# EAGLE schematic CM4 (EAGLE 9.6.2)
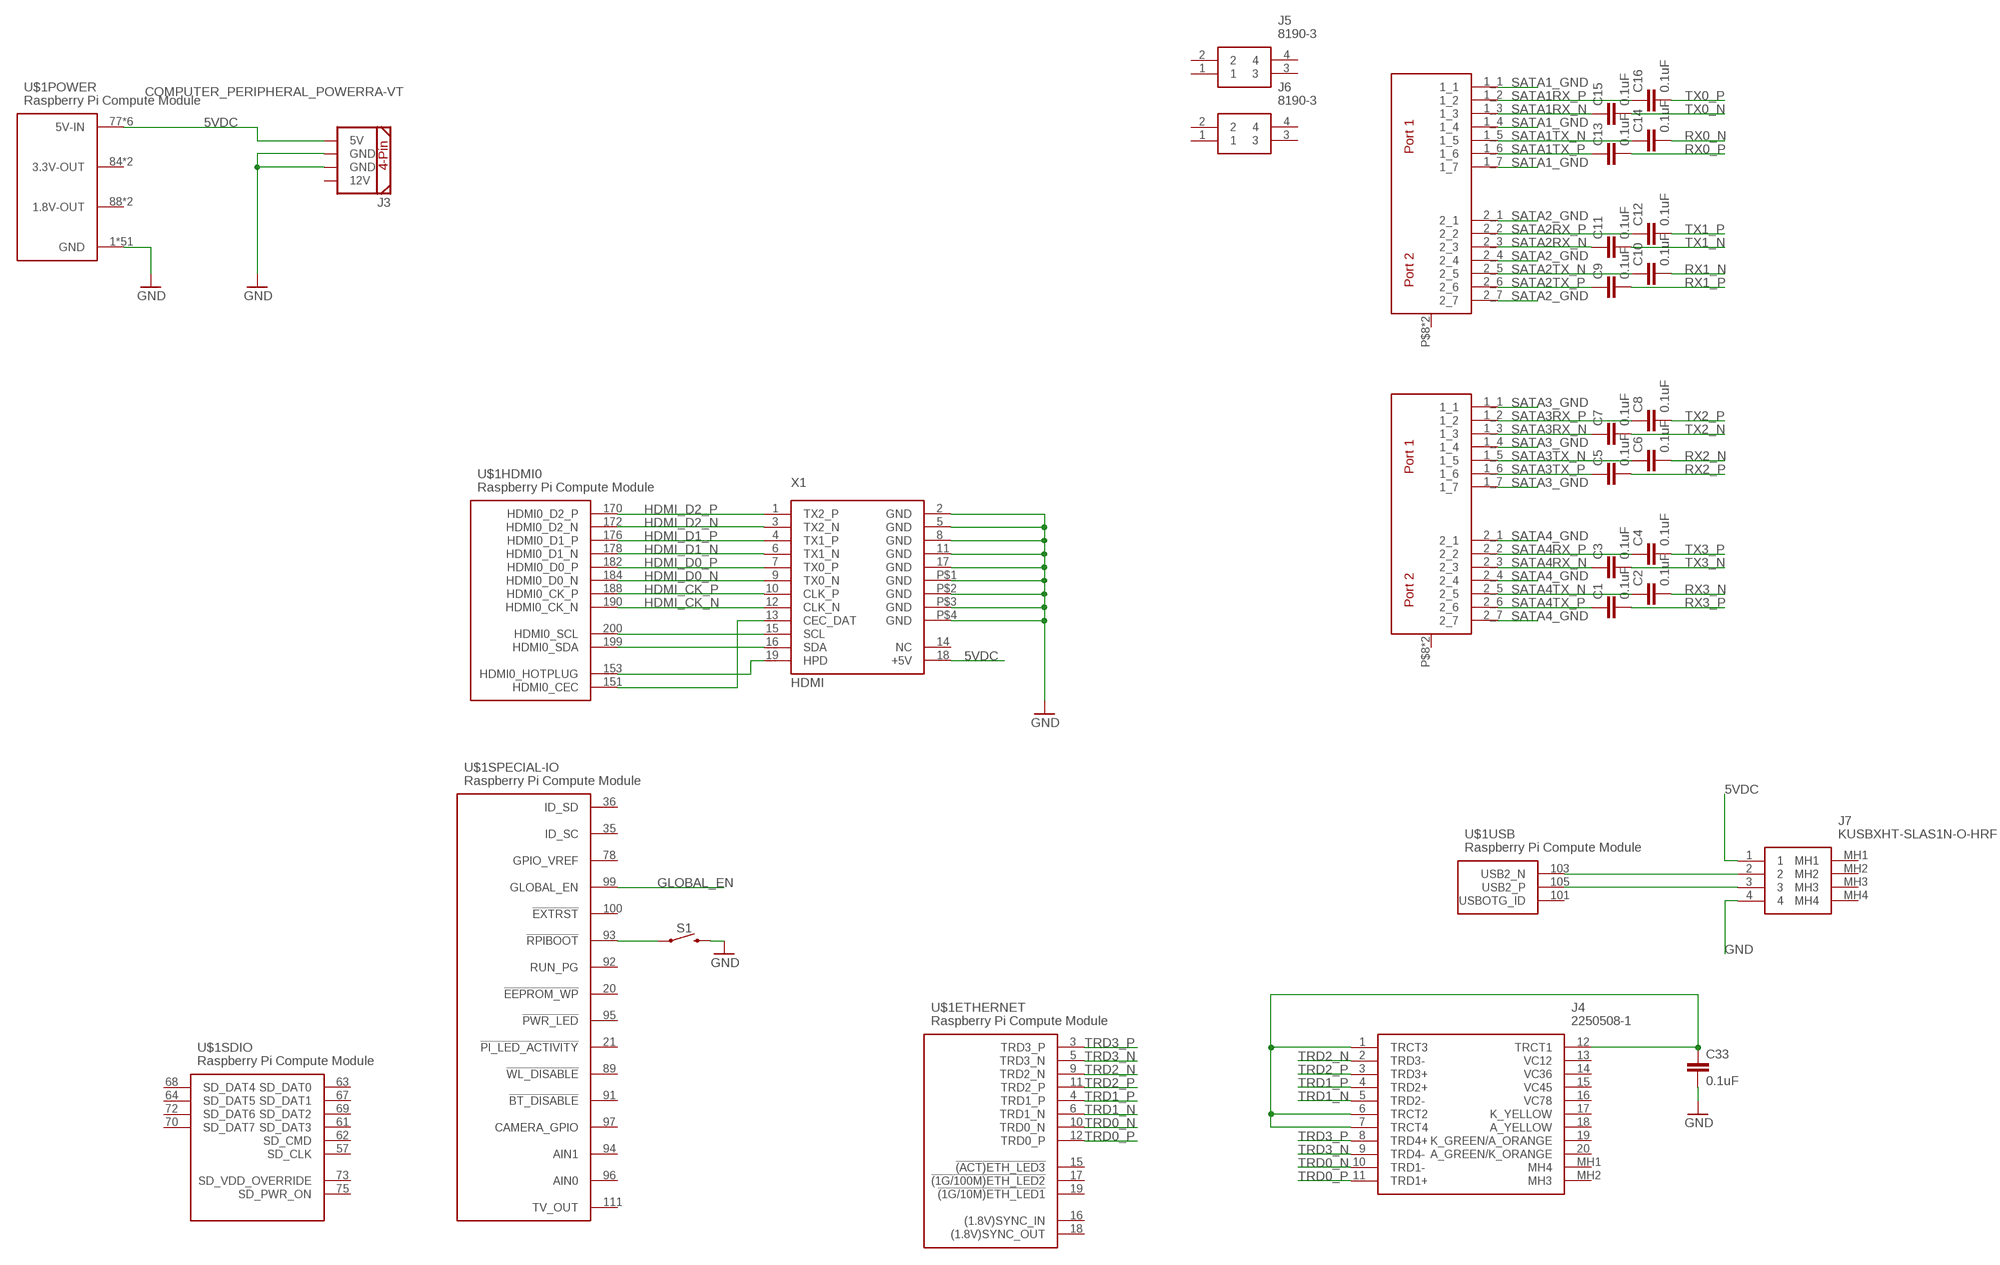
[diagram p0: schematic, sheet 1, part 1 of 2]
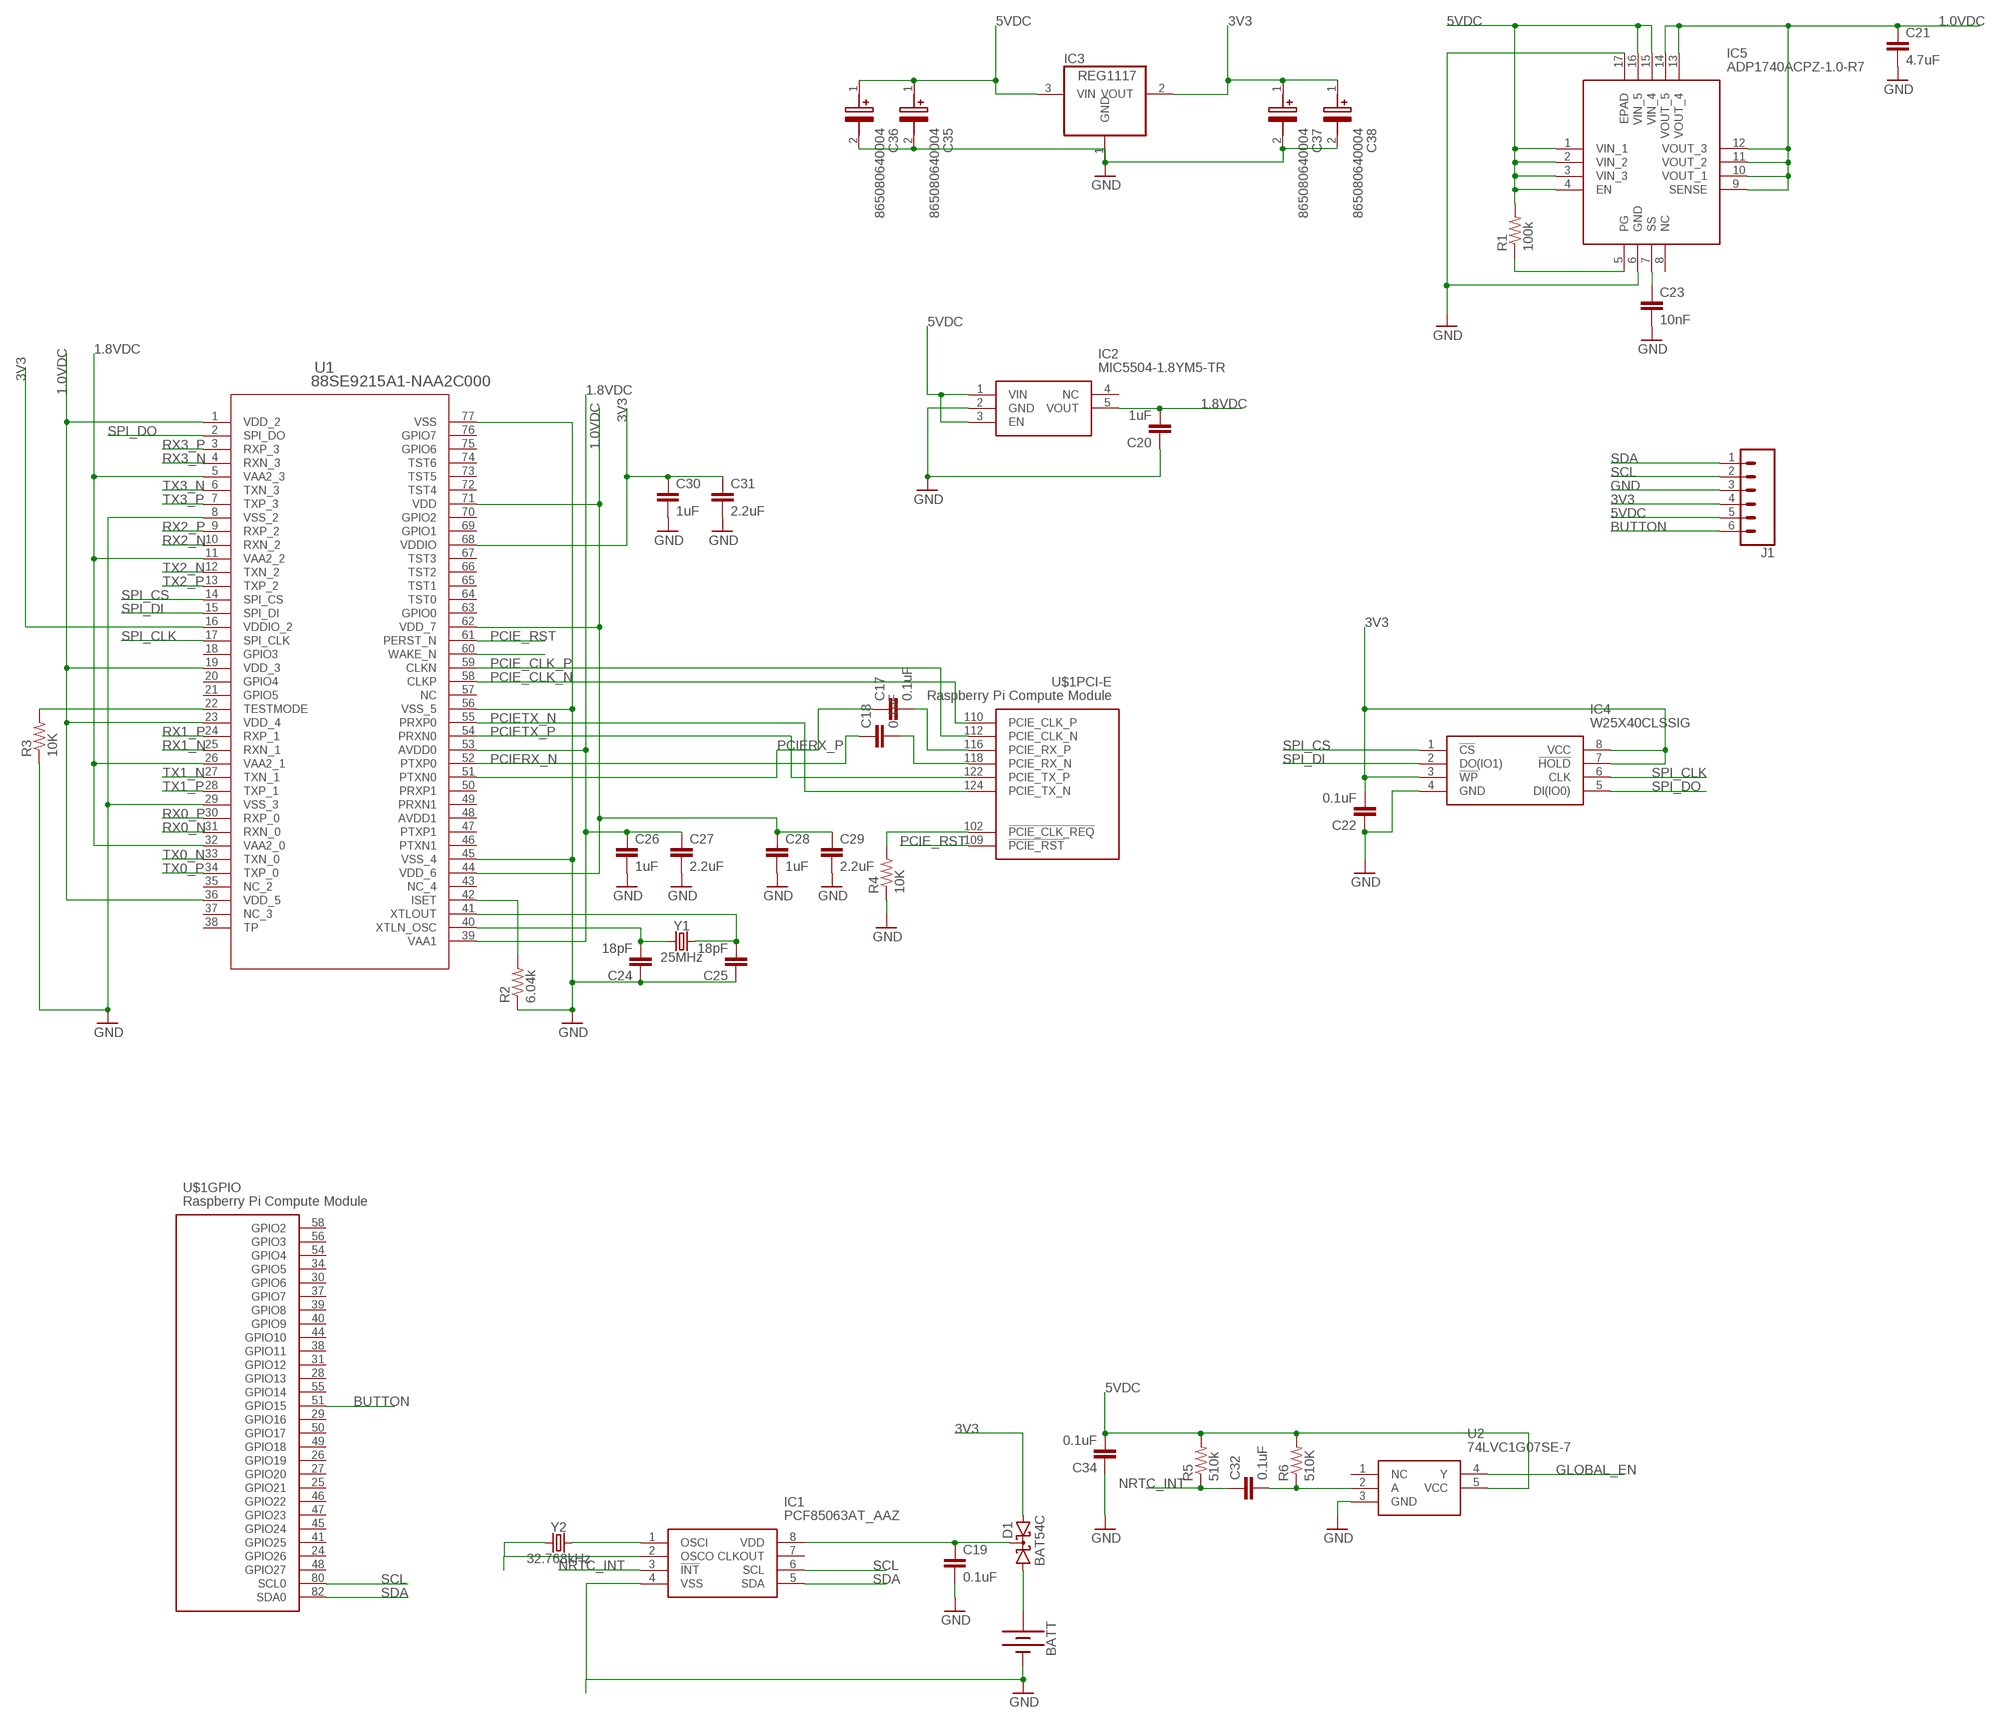
[diagram p1: schematic, sheet 1, part 2 of 2]

## Parts
BATT  BATTERY-12MM_SMD  [BATTCON_12MM]
C1  0.1uF  0.1UF-0603-25V-5%  [0603]
C2  0.1uF  0.1UF-0603-25V-5%  [0603]
C3  0.1uF  0.1UF-0603-25V-5%  [0603]
C4  0.1uF  0.1UF-0603-25V-5%  [0603]
C5  0.1uF  0.1UF-0603-25V-5%  [0603]
C6  0.1uF  0.1UF-0603-25V-5%  [0603]
C7  0.1uF  0.1UF-0603-25V-5%  [0603]
C8  0.1uF  0.1UF-0603-25V-5%  [0603]
C9  0.1uF  0.1UF-0603-25V-5%  [0603]
C10  0.1uF  0.1UF-0603-25V-5%  [0603]
C11  0.1uF  0.1UF-0603-25V-5%  [0603]
C12  0.1uF  0.1UF-0603-25V-5%  [0603]
C13  0.1uF  0.1UF-0603-25V-5%  [0603]
C14  0.1uF  0.1UF-0603-25V-5%  [0603]
C15  0.1uF  0.1UF-0603-25V-5%  [0603]
C16  0.1uF  0.1UF-0603-25V-5%  [0603]
C17  0.1uF  0.1UF-0603-25V-5%  [0603]
C18  0.1uF  0.1UF-0603-25V-5%  [0603]
C19  0.1uF  0.1UF-0603-25V-5%  [0603]
C20  1uF  0.1UF-0603-25V-5%  [0603]
C21  4.7uF  4.7UF-0603-6.3V-(10%)  [0603]
C22  0.1uF  0.1UF-0603-25V-5%  [0603]
C23  10nF  4.7UF-0603-6.3V-(10%)  [0603]
C24  18pF  0.1UF-0603-25V-5%  [0603]
C25  18pF  0.1UF-0603-25V-5%  [0603]
C26  1uF  4.7UF-0603-6.3V-(10%)  [0603]
C27  2.2uF  4.7UF-0603-6.3V-(10%)  [0603]
C28  1uF  4.7UF-0603-6.3V-(10%)  [0603]
C29  2.2uF  4.7UF-0603-6.3V-(10%)  [0603]
C30  1uF  4.7UF-0603-6.3V-(10%)  [0603]
C31  2.2uF  4.7UF-0603-6.3V-(10%)  [0603]
C32  0.1uF  0.1UF-0603-25V-5%  [0603]
C33  0.1uF  0.1UF-0603-25V-5%  [0603]
C34  0.1uF  0.1UF-0603-25V-5%  [0603]
C35  865080640004  [865080640004]
C36  865080640004  [865080640004]
C37  865080640004  [865080640004]
C38  865080640004  [865080640004]
D1  BAT54C  [SOT23]
IC1  PCF85063AT_AAZ  [SOIC127P600X175-8N]
IC2  MIC5504-1.8YM5-TR  [SOT95P280X145-5N]
IC3  REG1117  [SOT223]
IC4  W25X40CLSSIG  [SOIC127P790X216-8N]
IC5  ADP1740ACPZ-1.0-R7  [QFN65P400X400X80-17N]
J1  CONN_06LOCK  [1X06_LOCK]
J3  COMPUTER_PERIPHERAL_POWERRA-VT  [COMPUTER-PERIPHERAL-POWER-RA-VT]
J4  2250508-1  [22505081]
J5  8190-3  [81903]
J6  8190-3  [81903]
J7  KUSBXHT-SLAS1N-O-HRF  [KUSBXHTSLAS1NOHRF]
R1  100k  R-US_R0603  [R0603]
R2  6.04k  R-US_R0603  [R0603]
R3  10K  R-US_R0603  [R0603]
R4  10K  R-US_R0603  [R0603]
R5  510k  R-US_R0603  [R0603]
R6  510K  R-US_R0603  [R0603]
S1  MOMENTARY-SWITCH-SPST-SMD-5.2-REDUNDANT  [TACTILE_SWITCH_SMD_5.2MM]
U1  88SE9215A1-NAA2C000  [QFN76_9X9_MTG]
U2  74LVC1G07SE-7  [SOT65P210X110-5N]
U$1  Raspberry Pi Compute Module  RASPBERRYPI-CM4  [RASPBERRYPI-CM4]
U$2  SATA-D-PL-RT  [RIGHTANGLE2PORTSATA]
U$3  SATA-D-PL-RT  [RIGHTANGLE2PORTSATA]
X1  HDMI  [HDMI]
Y1  25MHz  CRYSTAL-25MHZ-SMD-2.0X1.6MM  [CRYSTAL-SMD-2.0X1.6MM]
Y2  32.768kHz  CRYSTAL-32.768KHZSMD-3.2X1.5  [CRYSTAL-SMD-3.2X1.5MM]

## Nets
1.0VDC: C21.1 C28.1 C29.1 IC5.9(SENSE) IC5.10(VOUT_1) IC5.11(VOUT_2) IC5.12(VOUT_3) IC5.13(VOUT_4) IC5.14(VOUT_5) U1.1(VDD_2) U1.19(VDD_3) U1.23(VDD_4) U1.36(VDD_5) U1.44(VDD_6) U1.62(VDD_7) U1.71(VDD)
1.8VDC: C20.2 C26.1 C27.1 IC2.5(VOUT) U1.5(VAA2_3) U1.11(VAA2_2) U1.26(VAA2_1) U1.32(VAA2_0) U1.39(VAA1) U1.53(AVDD0)
3V3: C22.2 C30.1 C31.1 C37.1(+) C38.1(+) D1.2(A2) IC3.2(VOUT) IC4.3(!WP) IC4.7(!HOLD) IC4.8(VCC) J1.4 U1.16(VDDIO_2) U1.68(VDDIO)
5VDC: C34.2 C35.1(+) C36.1(+) IC2.1(VIN) IC2.3(EN) IC3.3(VIN) IC5.1(VIN_1) IC5.2(VIN_2) IC5.3(VIN_3) IC5.4(EN) IC5.15(VIN_4) IC5.16(VIN_5) J1.5 J3.5V J7.1 R1.2 R5.2 R6.2 U2.5(VCC) U$1.77(POWER:5V-IN) U$1.79(POWER:5V-IN) U$1.81(POWER:5V-IN) U$1.83(POWER:5V-IN) U$1.85(POWER:5V-IN) U$1.87(POWER:5V-IN) X1.18(+5V)
BUTTON: J1.6 U$1.51(GPIO:GPIO15)
GLOBAL_EN: U2.4(Y) U$1.99(SPECIAL-IO:GLOBAL_EN)
GND: BATT.GND(-) C19.2 C20.1 C21.2 C22.1 C23.2 C24.1 C25.1 C26.2 C27.2 C28.2 C29.2 C30.2 C31.2 C33.2 C34.1 C35.2(-) C36.2(-) C37.2(-) C38.2(-) IC1.4(VSS) IC2.2(GND) IC3.1(GND) IC4.4(GND) IC5.6(GND) IC5.17(EPAD) J1.3 J3.GND@1(GND) J3.GND@2(GND) J7.4 R2.1 R3.1 R4.1 S1.3 S1.4 U1.8(VSS_2) U1.29(VSS_3) U1.45(VSS_4) U1.56(VSS_5) U1.77(VSS) U2.3(GND) U$1.1(POWER:GND) U$1.2(POWER:GND) U$1.7(POWER:GND) U$1.8(POWER:GND) U$1.13(POWER:GND) U$1.14(POWER:GND) U$1.22(POWER:GND) U$1.23(POWER:GND) U$1.32(POWER:GND) U$1.33(POWER:GND) U$1.42(POWER:GND) U$1.43(POWER:GND) U$1.52(POWER:GND) U$1.53(POWER:GND) U$1.59(POWER:GND) U$1.60(POWER:GND) U$1.65(POWER:GND) U$1.66(POWER:GND) U$1.71(POWER:GND) U$1.74(POWER:GND) U$1.98(POWER:GND) U$1.107(POWER:GND) U$1.108(POWER:GND) U$1.113(POWER:GND) U$1.114(POWER:GND) U$1.119(POWER:GND) U$1.120(POWER:GND) U$1.125(POWER:GND) U$1.126(POWER:GND) U$1.131(POWER:GND) U$1.132(POWER:GND) U$1.137(POWER:GND) U$1.138(POWER:GND) U$1.144(POWER:GND) U$1.150(POWER:GND) U$1.155(POWER:GND) U$1.156(POWER:GND) U$1.161(POWER:GND) U$1.162(POWER:GND) U$1.167(POWER:GND) U$1.168(POWER:GND) U$1.173(POWER:GND) U$1.174(POWER:GND) U$1.179(POWER:GND) U$1.180(POWER:GND) U$1.185(POWER:GND) U$1.186(POWER:GND) U$1.191(POWER:GND) U$1.192(POWER:GND) U$1.197(POWER:GND) U$1.198(POWER:GND) X1.2(GND) X1.5(GND) X1.8(GND) X1.11(GND) X1.17(GND) X1.P$1(GND) X1.P$2(GND) X1.P$3(GND) X1.P$4(GND)
HDMI_CK_N: U$1.190(HDMI0:HDMI0_CK_N) X1.12(CLK_N)
HDMI_CK_P: U$1.188(HDMI0:HDMI0_CK_P) X1.10(CLK_P)
HDMI_D0_N: U$1.184(HDMI0:HDMI0_D0_N) X1.9(TX0_N)
HDMI_D0_P: U$1.182(HDMI0:HDMI0_D0_P) X1.7(TX0_P)
HDMI_D1_N: U$1.178(HDMI0:HDMI0_D1_N) X1.6(TX1_N)
HDMI_D1_P: U$1.176(HDMI0:HDMI0_D1_P) X1.4(TX1_P)
HDMI_D2_N: U$1.172(HDMI0:HDMI0_D2_N) X1.3(TX2_N)
HDMI_D2_P: U$1.170(HDMI0:HDMI0_D2_P) X1.1(TX2_P)
N$1: C23.1 IC5.7(SS)
N$3: IC5.5(PG) R1.1
N$4: C24.2 U1.40(XTLN_OSC) Y1.1
N$5: C25.2 U1.41(XTLOUT) Y1.3
N$6: C33.1 J4.1(TRCT3) J4.6(TRCT2) J4.7(TRCT4) J4.12(TRCT1)
N$7: S1.1 S1.2 U$1.93(SPECIAL-IO:!RPIBOOT)
N$8: R2.2 U1.42(ISET)
N$9: U$1.200(HDMI0:HDMI0_SCL) X1.15(SCL)
N$10: U$1.199(HDMI0:HDMI0_SDA) X1.16(SDA)
N$11: U$1.153(HDMI0:HDMI0_HOTPLUG) X1.19(HPD)
N$12: U$1.151(HDMI0:HDMI0_CEC) X1.13(CEC_DAT)
N$13: IC1.1(OSCI) Y2.P$2
N$14: IC1.2(OSCO) Y2.P$1
N$16: C32.2 R6.1 U2.2(A)
N$18: J7.2 U$1.103(USB:USB2_N)
N$19: J7.3 U$1.105(USB:USB2_P)
N$24: BATT.PWR@1(+) D1.1(A1)
N$25: C19.1 D1.3(CC) IC1.8(VDD)
N$67: R3.2 U1.22(TESTMODE)
N$68: U1.60(WAKE_N)
N$69: R4.2 U$1.102(PCI-E:!PCIE_CLK_REQ)
NRTC_INT: C32.1 IC1.3(!INT) R5.1
PCIE_CLK_N: U1.58(CLKP) U$1.110(PCI-E:PCIE_CLK_P)
PCIE_CLK_P: U1.59(CLKN) U$1.112(PCI-E:PCIE_CLK_N)
PCIE_RST: U1.61(PERST_N) U$1.109(PCI-E:!PCIE_RST)
PCIERX_N: C18.1 U1.52(PTXP0)
PCIERX_P: C17.1 U1.51(PTXN0)
PCIERXCAP_N: C18.2 U$1.118(PCI-E:PCIE_RX_N)
PCIERXCAP_P: C17.2 U$1.116(PCI-E:PCIE_RX_P)
PCIETX_N: U1.55(PRXP0) U$1.124(PCI-E:PCIE_TX_N)
PCIETX_P: U1.54(PRXN0) U$1.122(PCI-E:PCIE_TX_P)
RX0_N [diff pairs]: C14.2 U1.31(RXN_0)
RX0_P [diff pairs]: C13.2 U1.30(RXP_0)
RX1_N [diff pairs]: C10.2 U1.25(RXN_1)
RX1_P [diff pairs]: C9.2 U1.24(RXP_1)
RX2_N [diff pairs]: C6.2 U1.10(RXN_2)
RX2_P [diff pairs]: C5.2 U1.9(RXP_2)
RX3_N [diff pairs]: C2.2 U1.4(RXN_3)
RX3_P [diff pairs]: C1.2 U1.3(RXP_3)
SATA1_GND: U$2.1_1 U$2.1_4 U$2.1_7
SATA1RX_N [diff pairs]: C15.1 U$2.1_3
SATA1RX_P [diff pairs]: C16.1 U$2.1_2
SATA1TX_N [diff pairs]: C14.1 U$2.1_5
SATA1TX_P [diff pairs]: C13.1 U$2.1_6
SATA2_GND [diff pairs]: U$2.2_1 U$2.2_4 U$2.2_7
SATA2RX_N [diff pairs]: C11.1 U$2.2_3
SATA2RX_P [diff pairs]: C12.1 U$2.2_2
SATA2TX_N [diff pairs]: C10.1 U$2.2_5
SATA2TX_P [diff pairs]: C9.1 U$2.2_6
SATA3_GND [diff pairs]: U$3.1_1 U$3.1_4 U$3.1_7
SATA3RX_N [diff pairs]: C7.1 U$3.1_3
SATA3RX_P [diff pairs]: C8.1 U$3.1_2
SATA3TX_N [diff pairs]: C6.1 U$3.1_5
SATA3TX_P [diff pairs]: C5.1 U$3.1_6
SATA4_GND [diff pairs]: U$3.2_1 U$3.2_4 U$3.2_7
SATA4RX_N [diff pairs]: C3.1 U$3.2_3
SATA4RX_P [diff pairs]: C4.1 U$3.2_2
SATA4TX_N [diff pairs]: C2.1 U$3.2_5
SATA4TX_P [diff pairs]: C1.1 U$3.2_6
SCL: IC1.6(SCL) J1.2 U$1.80(GPIO:SCL0)
SDA: IC1.5(SDA) J1.1 U$1.82(GPIO:SDA0)
SPI_CLK: IC4.6(CLK) U1.17(SPI_CLK)
SPI_CS: IC4.1(!CS) U1.14(SPI_CS)
SPI_DI: IC4.2(DO(IO1)) U1.15(SPI_DI)
SPI_DO: IC4.5(DI(IO0)) U1.2(SPI_DO)
TRD0_N: J4.10(TRD1-) U$1.10(ETHERNET:TRD0_N)
TRD0_P: J4.11(TRD1+) U$1.12(ETHERNET:TRD0_P)
TRD1_N: J4.5(TRD2-) U$1.6(ETHERNET:TRD1_N)
TRD1_P: J4.4(TRD2+) U$1.4(ETHERNET:TRD1_P)
TRD2_N: J4.2(TRD3-) U$1.9(ETHERNET:TRD2_N)
TRD2_P: J4.3(TRD3+) U$1.11(ETHERNET:TRD2_P)
TRD3_N: J4.9(TRD4-) U$1.5(ETHERNET:TRD3_N)
TRD3_P: J4.8(TRD4+) U$1.3(ETHERNET:TRD3_P)
TX0_N [diff pairs]: C15.2 U1.33(TXN_0)
TX0_P [diff pairs]: C16.2 U1.34(TXP_0)
TX1_N [diff pairs]: C11.2 U1.27(TXN_1)
TX1_P [diff pairs]: C12.2 U1.28(TXP_1)
TX2_N [diff pairs]: C7.2 U1.12(TXN_2)
TX2_P [diff pairs]: C8.2 U1.13(TXP_2)
TX3_N [diff pairs]: C3.2 U1.6(TXN_3)
TX3_P [diff pairs]: C4.2 U1.7(TXP_3)
Unconnected: IC1.7(CLKOUT) IC2.4(NC) IC5.8(NC) J3.12V J4.13(VC12) J4.14(VC36) J4.15(VC45) J4.16(VC78) J4.17(K_YELLOW) J4.18(A_YELLOW) J4.19(K_GREEN/A_ORANGE) J4.20(A_GREEN/K_ORANGE) J4.MH1(MH4) J4.MH2(MH3) J5.1 J5.2 J5.3 J5.4 J6.1 J6.2 J6.3 J6.4 J7.MH1 J7.MH2 J7.MH3 J7.MH4 U1.18(GPIO3) U1.20(GPIO4) U1.21(GPIO5) U1.35(NC_2) U1.37(NC_3) U1.38(TP) U1.43(NC_4) U1.46(PTXN1) U1.47(PTXP1) U1.49(PRXN1) U1.50(PRXP1) U1.57(NC) U1.63(GPIO0) U1.64(TST0) U1.65(TST1) U1.66(TST2) U1.67(TST3) U1.69(GPIO1) U1.70(GPIO2) U1.72(TST4) U1.73(TST5) U1.74(TST6) U1.75(GPIO6) U1.76(GPIO7) U2.1(NC) U$1.15(ETHERNET:!(ACT)ETH_LED3) U$1.16(ETHERNET:(1.8V)SYNC_IN) U$1.17(ETHERNET:!(1G/100M)ETH_LED2) U$1.18(ETHERNET:(1.8V)SYNC_OUT) U$1.19(ETHERNET:!(1G/10M)ETH_LED1) U$1.20(SPECIAL-IO:!EEPROM_WP) U$1.21(SPECIAL-IO:!PI_LED_ACTIVITY) U$1.24(GPIO:GPIO26) U$1.25(GPIO:GPIO21) U$1.26(GPIO:GPIO19) U$1.27(GPIO:GPIO20) U$1.28(GPIO:GPIO13) U$1.29(GPIO:GPIO16) U$1.30(GPIO:GPIO6) U$1.31(GPIO:GPIO12) U$1.34(GPIO:GPIO5) U$1.35(SPECIAL-IO:ID_SC) U$1.36(SPECIAL-IO:ID_SD) U$1.37(GPIO:GPIO7) U$1.38(GPIO:GPIO11) U$1.39(GPIO:GPIO8) U$1.40(GPIO:GPIO9) U$1.41(GPIO:GPIO25) U$1.44(GPIO:GPIO10) U$1.45(GPIO:GPIO24) U$1.46(GPIO:GPIO22) U$1.47(GPIO:GPIO23) U$1.48(GPIO:GPIO27) U$1.49(GPIO:GPIO18) U$1.50(GPIO:GPIO17) U$1.54(GPIO:GPIO4) U$1.55(GPIO:GPIO14) U$1.56(GPIO:GPIO3) U$1.57(SDIO:SD_CLK) U$1.58(GPIO:GPIO2) U$1.61(SDIO:SD_DAT3) U$1.62(SDIO:SD_CMD) U$1.63(SDIO:SD_DAT0) U$1.64(SDIO:SD_DAT5) U$1.67(SDIO:SD_DAT1) U$1.68(SDIO:SD_DAT4) U$1.69(SDIO:SD_DAT2) U$1.70(SDIO:SD_DAT7) U$1.72(SDIO:SD_DAT6) U$1.73(SDIO:SD_VDD_OVERRIDE) U$1.75(SDIO:SD_PWR_ON) U$1.78(SPECIAL-IO:GPIO_VREF) U$1.89(SPECIAL-IO:!WL_DISABLE) U$1.91(SPECIAL-IO:!BT_DISABLE) U$1.92(SPECIAL-IO:RUN_PG) U$1.94(SPECIAL-IO:AIN1) U$1.95(SPECIAL-IO:!PWR_LED) U$1.96(SPECIAL-IO:AIN0) U$1.97(SPECIAL-IO:CAMERA_GPIO) U$1.100(SPECIAL-IO:!EXTRST) U$1.101(USB:USBOTG_ID) U$1.111(SPECIAL-IO:TV_OUT) U$1.115(CAM1:CAM1_D0_N) U$1.117(CAM1:CAM1_D0_P) U$1.121(CAM1:CAM1_D1_N) U$1.123(CAM1:CAM1_D1_P) U$1.127(CAM1:CAM1_C_N) U$1.128(CAM0:CAM0_D0_N) U$1.129(CAM1:CAM1_C_P) U$1.130(CAM0:CAM0_D0_P) U$1.133(CAM1:CAM1_D2_N) U$1.134(CAM0:CAM0_D1_N) U$1.135(CAM1:CAM1_D2_P) U$1.136(CAM0:CAM0_D1_P) U$1.139(CAM1:CAM1_D3_N) U$1.140(CAM0:CAM0_C_N) U$1.141(CAM1:CAM1_D3_P) U$1.142(CAM0:CAM0_C_P) U$1.143(HDMI1:HDMI1_HOTPLUG) U$1.145(HDMI1:HDMI1_SDA) U$1.146(HDMI1:HDMI1_D2_P) U$1.147(HDMI1:HDMI1_SCL) U$1.148(HDMI1:HDMI1_D2_N) U$1.149(HDMI1:HDMI1_CEC) U$1.152(HDMI1:HDMI1_D1_P) U$1.154(HDMI1:HDMI1_D1_N) U$1.157(DSI0:DSI0_D0_N) U$1.158(HDMI1:HDMI1_D0_P) U$1.159(DSI0:DSI0_D0_P) U$1.160(HDMI1:HDMI1_D0_N) U$1.163(DSI0:DSI0_D1_N) U$1.164(HDMI1:HDMI1_CK_P) U$1.165(DSI0:DSI0_D1_P) U$1.166(HDMI1:HDMI1_CK_N) U$1.169(DSI0:DSI0_C_N) U$1.171(DSI0:DSI0_C_P) U$1.175(DSI1:DSI1_D0_N) U$1.177(DSI1:DSI1_D0_P) U$1.181(DSI1:DSI1_D1_N) U$1.183(DSI1:DSI1_D1_P) U$1.187(DSI1:DSI1_C_N) U$1.189(DSI1:DSI1_C_P) U$1.193(DSI1:DSI1_D2_N) U$1.194(DSI1:DSI1_D3_N) U$1.195(DSI1:DSI1_D2_P) U$1.196(DSI1:DSI1_D3_P) U$2.P$8 U$2.P$9 U$3.P$8 U$3.P$9 X1.14(NC)

## Power pins joined to a net without a drawn wire
1.8V-OUT: U$1.88(POWER:1.8V-OUT) U$1.90(POWER:1.8V-OUT)
3.3V-OUT: U$1.84(POWER:3.3V-OUT) U$1.86(POWER:3.3V-OUT)
AVDD1: U1.48(AVDD1)

## Library data of the parts
BATT = SparkFun-Batteries:BATTERY: Battery - Single Cell A variety of battery chemistries, sizes, and footprints. Device List: 20MM_PTH - Coin Cell Battery Holder - 20mm (PTH) <https://www.sparkfun.com/products/783> 6.8MM_PTH - Coin Cell Battery Holder - 6.8MM(SMD) <https://www.digikey.com/product-detail/en/seiko-instruments/MS621FE-FL11E/728-1057-ND/1889208?WT.srch=1&gclid=CNOQ5a6LzdQCFZS2wAodXCkE0g> 12MM_SMD - Coin Cell Battery Holder - 12mm (SMD) <https://www.sparkfun.com/products/10592> 12MM_PTH - Coin Cell Battery Holder - 12mm (PTH) <https://www.sparkfun.com/products/7948> 20MM_SMD - 20mm Coin Cell Battery Holder (SMD) (2 legs) Used on the Big Time Watch Kit <https://www.sparkfun.com/products/11734> 20MM_SMD_4LEGS - Coin Cell Battery Holder - 20mm (SMD) <https://www.sparkfun.com/products/11892> 20MM_SMD_4LEGS_OVERPASTE - Coin Cell Battery Holder - 20mm (SMD) <https://www.sparkfun.com/products/11892> (Over-paste on the legs) 24.5MM_PTH - Coin Cell Battery Holder - 24.5mm (PTH) <https://www.sparkfun.com/products/8863> 9V - 9V Battery Holder - PC Mount Used on the SparkFun SparkPunk Sound Kit <https://www.sparkfun.com/products/11177> and SparkFun SparkPunk Sequencer Kit <https://www.sparkfun.com/products/12707> 18650 - Battery Holder - 18650 (PTH) <https://www.sparkfun.com/products/13113> AA - Battery Holder - 1xAA (PTH) <https://www.sparkfun.com/products/7949> AAA - Battery Holder - 1xAAA (PTH) <https://www.sparkfun.com/products/12718> AA_KIT - Battery Holder - 1xAA (PTH) <https://www.sparkfun.com/products/7949> Special kit package - pads only have exposed copper on one side of the board. AAA_KIT - Battery Holder - 1xAAA (PTH) <https://www.sparkfun.com/products/12718> Special kit package - pads only have exposed copper on one side of the board.; PROD_ID: BATT-08044; SF_SKU: PRT-10592
C1-C19 C22 C32-C34 = SparkFun-Capacitors:0.1UF: 0.1µF ceramic capacitors A capacitor is a passive two-terminal electrical component used to store electrical energy temporarily in an electric field.; PROD_ID: CAP-08604
C20 C24 C25 = SparkFun-Capacitors:0.1UF: 0.1µF ceramic capacitors A capacitor is a passive two-terminal electrical component used to store electrical energy temporarily in an electric field.; PROD_ID: CAP-08604; VALUE: 0.1uF
C21 = SparkFun-Capacitors:4.7UF: 4.7µF ceramic capacitors A capacitor is a passive two-terminal electrical component used to store electrical energy temporarily in an electric field.; PROD_ID: CAP-08280
C23 C26-C31 = SparkFun-Capacitors:4.7UF: 4.7µF ceramic capacitors A capacitor is a passive two-terminal electrical component used to store electrical energy temporarily in an electric field.; PROD_ID: CAP-08280; VALUE: 4.7uF
C35-C38 = SamacSys_Parts:865080640004: WURTH ELEKTRONIK - 865080640004 - SMD Aluminium Electrolytic Capacitor, Radial Can - SMD, 4.7 F, 50 V, WCAP-ASLI Series Source: Datasheet <https://www.we-online.de/katalog/datasheet/865080640004.pdf>; DESCRIPTION: WURTH ELEKTRONIK - 865080640004 - SMD Aluminium Electrolytic Capacitor, Radial Can - SMD, 4.7 F, 50 V, WCAP-ASLI Series; HEIGHT: 5.5mm; MANUFACTURER_NAME: Wurth Elektronik; MANUFACTURER_PART_NUMBER: 865080640004; MOUSER_PART_NUMBER: 710-865080640004; MOUSER_PRICE-STOCK: https://www.mouser.co.uk/ProductDetail/Wurth-Elektronik/865080640004?qs=0KOYDY2FL2%2FjY4kqBxIvAg%3D%3D
D1 = diode:BAT54C: Schottky Diodes Source: Fairchild .. BAT54.pdf
IC1 = SamacSys_Parts:PCF85063AT_AAZ: Real Time Clock Low Power Real time clocks Source: Datasheet <http://www.nxp.com/docs/en/data-sheet/PCF85063A.pdf>; DESCRIPTION: Real Time Clock Low Power Real time clocks; HEIGHT: 1.75mm; MANUFACTURER_NAME: NXP; MANUFACTURER_PART_NUMBER: PCF85063AT/AAZ; MOUSER_PART_NUMBER: 771-PCF85063AT/AAZ; MOUSER_PRICE-STOCK: https://www.mouser.co.uk/ProductDetail/NXP-Semiconductors/PCF85063AT-AAZ?qs=sV%252BQJnSpgu9E5WpV9lmUdg%3D%3D
IC2 = SamacSys_Parts:MIC5504-1.8YM5-TR: Linear Voltage Regulator IC Positive Fixed Output 1.8V 300mA SOT-23-5 Source: Datasheet <http://www.microchip.com/mymicrochip/filehandler.aspx?ddocname=en580292>; DESCRIPTION: Linear Voltage Regulator IC Positive Fixed Output 1.8V 300mA SOT-23-5; HEIGHT: 1.45mm; MANUFACTURER_NAME: Microchip; MANUFACTURER_PART_NUMBER: MIC5504-1.8YM5-TR; MOUSER_PART_NUMBER: 998-MIC5504-1.8YM5TR; MOUSER_PRICE-STOCK: https://www.mouser.co.uk/ProductDetail/Microchip-Technology/MIC5504-1.8YM5-TR?qs=U6T8BxXiZAWcKt0MaB%252BQvA%3D%3D
IC3 = burr-brown:REG1117: 800mA and 1A Low Dropout (LDO) Positive Regulator 1.8V, 2.5V, 2.85V, 3.3V, 5V, and Adj; MPN: REG1117; OC_FARNELL: 1097566; OC_NEWARK: 14P6981
IC4 = SamacSys_Parts:W25X40CLSSIG: 4M-bit 2.5V Serial Flash Memory with uniform 4KB sectors and Dual SPI Source: Datasheet <https://www.winbond.com/hq/search-resource-file.jsp?partNo=W25X40CLSSIG&type=datasheet>; DESCRIPTION: 4M-bit 2.5V Serial Flash Memory with uniform 4KB sectors and Dual SPI; HEIGHT: 2.16mm; MANUFACTURER_NAME: Winbond; MANUFACTURER_PART_NUMBER: W25X40CLSSIG; MOUSER_PART_NUMBER: 454-W25X40CLSSIG; MOUSER_PRICE-STOCK: https://www.mouser.co.uk/ProductDetail/Winbond/W25X40CLSSIG?qs=qSfuJ%252Bfl%2Fd62fNekK5kYWQ%3D%3D
IC5 = SamacSys_Parts:ADP1740ACPZ-1.0-R7: Linear Voltage Regulators 2A LDO Fix V-out Family Source: Datasheet <https://ms.componentsearchengine.com/Datasheets/1/ADP1740ACPZ-1.0-R7.pdf>; DESCRIPTION: Linear Voltage Regulators 2A LDO Fix V-out Family; HEIGHT: 0.8mm; MANUFACTURER_NAME: Analog Devices; MANUFACTURER_PART_NUMBER: ADP1740ACPZ-1.0-R7; MOUSER_PART_NUMBER: 584-ADP1740ACPZ1.0R7; MOUSER_PRICE-STOCK: https://www.mouser.co.uk/ProductDetail/Analog-Devices/ADP1740ACPZ-1.0-R7?qs=WIvQP4zGang3BakwF5q%252B6g%3D%3D
J1 = SparkFun-Connectors:CONN_06: Multi connection point. Often used as Generic Header-pin footprint for 0.1 inch spaced/style header connections On any of the 0.1 inch spaced packages, you can populate with these: Break Away Headers - Straight <https://www.sparkfun.com/products/116> (PRT-00116) Break Away Male Headers - Right Angle <https://www.sparkfun.com/products/553> (PRT-00553) Female Headers <https://www.sparkfun.com/products/115> (PRT-00115) Break Away Headers - Machine Pin <https://www.sparkfun.com/products/117> (PRT-00117) Break Away Female Headers - Swiss Machine Pin <https://www.sparkfun.com/products/743> (PRT-00743) Arduino Stackable Header - 6 Pin <https://www.sparkfun.com/products/9280> (PRT-09280) For SCREWTERMINALS and SPRING TERMINALS visit here: Screw Terimnals on SparkFun.com <https://www.sparkfun.com/search/results?term=Screw+Terminals> (5mm/3.5mm/2.54mm spacing) This device is also useful as a general connection point to wire up your design to another part of your project. Our various solder wires solder well into these plated through hole pads. Hook-Up Wire - Assortment (Stranded, 22 AWG) <https://www.sparkfun.com/products/11375> (PRT-11375) Hook-Up Wire - Assortment (Solid Core, 22 AWG) <https://www.sparkfun.com/products/11367> (PRT-11367) View the entire wire category on our website here <https://www.sparkfun.com/categories/141>
J3 = SparkFun-Connectors:COMPUTER_PERIPHERAL_POWER: ATX 4-Pin Power Supply Connector - Right Angle and Vertical PTH Mount This is a good connector for connecting a computer power supply to a PCB. It is commonly known as the Molex series 8981 connector. The footprint is adjusted for the right angle and vertical connector mounts. SparkFun Products: ATX Connector Breakout Board <https://www.sparkfun.com/products/15035> ATX Right Angle Connector - PTH 4-Pin <https://www.sparkfun.com/products/15700> SparkFun ATX Power Connector Breakout Kit - 12V/5V (4-pin) <https://www.sparkfun.com/products/15701>; PROD_ID: PRT-15700
J4 = SamacSys_Parts:2250508-1: Modular Connectors / Ethernet Connectors RJ45,1X1,10G BASE-T TAB UP Source: Datasheet <https://www.belfuse.com/resources/drawings/magneticsolutions/dr-MAG-2250508-1.pdf>; DESCRIPTION: Modular Connectors / Ethernet Connectors RJ45,1X1,10G BASE-T TAB UP; HEIGHT: 15.46mm; MANUFACTURER_NAME: TRP Connector; MANUFACTURER_PART_NUMBER: 2250508-1; MOUSER_PART_NUMBER: 530-2250508-1; MOUSER_PRICE-STOCK: https://www.mouser.co.uk/ProductDetail/TRP-Connector-Bel/2250508-1?qs=TuK3vfAjtkVRPOica4dJyA%3D%3D
J5 J6 = SamacSys_Parts:8190-3: Keystone, Brass Screw Terminal, 22 14 AWG, Right Angle, 15A Source: Datasheet; DESCRIPTION: Keystone, Brass Screw Terminal, 22 14 AWG, Right Angle, 15A; HEIGHT: 7.92mm; MANUFACTURER_NAME: Keystone Electronics; MANUFACTURER_PART_NUMBER: 8190-3; MOUSER_PART_NUMBER: 534-8190-3; MOUSER_PRICE-STOCK: https://www.mouser.co.uk/ProductDetail/Keystone-Electronics/8190-3?qs=zBlGwAMnvtcaJ39GfBOPAg%3D%3D
J7 = SamacSys_Parts:KUSBXHT-SLAS1N-O-HRF: USB Connectors Upright-USB A Orang GF Plt-Cont High Ret Source: Datasheet <https://componentsearchengine.com/Datasheets/1/KUSBXHT-SLAS1N-O-HRF.pdf>; DESCRIPTION: USB Connectors Upright-USB A Orang GF Plt-Cont High Ret; HEIGHT: 14.5mm; MANUFACTURER_NAME: Kycon; MANUFACTURER_PART_NUMBER: KUSBXHT-SLAS1N-O-HRF; MOUSER_PART_NUMBER: 806-KUSBXHTSLAS1NHRF; MOUSER_PRICE-STOCK: https://www.mouser.co.uk/ProductDetail/Kycon/KUSBXHT-SLAS1N-O-HRF?qs=P1JMDcb91o7AxnUFFdjpGw%3D%3D
R1-R6 = rcl:R-US_: RESISTOR, American symbol; SPICEPREFIX: R
S1 = SparkFun-Switches:MOMENTARY-SWITCH-SPST: Momentary Switch (Pushbutton) - SPST Normally-open (NO) SPST momentary switches (buttons, pushbuttons). Variants PTH-12MM - 12mm square, through-hole Momentary Pushbutton Switch - 12mm Square <https://www.sparkfun.com/products/9190> (COM-09190) PTH-6.0MM, PTH-6.0MM-KIT - 6.0mm square, through-hole Mini Pushbutton Switch <https://www.sparkfun.com/products/97> (COM-00097) KIT package intended for soldering kit's - only one side of pads' copper is exposed. PTH-RIGHT-ANGLE-KIT - Right-angle, through-hole Right Angle Tactile Button <https://www.sparkfun.com/products/10791> - Used on SparkFun BigTime Watch Kit <https://www.sparkfun.com/products/11734> SMD-12MM - 12mm square, surface-mount Tactile Button - SMD (12mm) <https://www.sparkfun.com/products/12993> (COM-12993) Used on SparkFun PicoBoard <https://www.sparkfun.com/products/11888> SMD-4.5MM - 4.5mm Square Trackball Switch Used on SparkFun Blackberry Trackballer Breakout <https://www.sparkfun.com/products/13169> SMD-4.6MMX2.8MM - 4.60mm x 2.80mm, surface mount Used on SparkFun SAMD21 Mini Breakout <https://www.sparkfun.com/products/13664> SMD-5.2MM, SMD-5.2-REDUNDANT - 5.2mm square, surface-mount Mini Pushbutton Switch - SMD <https://www.sparkfun.com/products/8720> (COM-08720) Used on Arduino Pro Mini <https://www.sparkfun.com/products/11114> REDUNDANT package connects both switch circuits together SMD-6.0X3.5MM - 6.0 x 3.5mm, surface mount Momentary Reset Switch SMD <https://www.sparkfun.com/products/8229> (COM-08229) SMD-6.2MM-TALL - 6.2mm square, surface mount Tactile Button - SMD (6mm) <https://www.sparkfun.com/products/12992> Used on SparkFun Digital Sandbox <https://www.sparkfun.com/products/12651> SMD-RIGHT-ANGLE - Right-angle, surface mount Used on SparkFun Block for Intel® Edison - Arduino <https://www.sparkfun.com/products/13036>; PROD_ID: SWCH-08247; SF_SKU: COM-08720
U1 = MarvellSATA:88SE9215A1-NAA2C000; COPYRIGHT: Copyright (C) 2023 Ultra Librarian. All rights reserved.; MANUFACTURER_PART_NUMBER: 88SE9215A1-NAA2C000; MFR_NAME: Marvell
U2 = SamacSys_Parts:74LVC1G07SE-7: Buffers & Line Drivers Single Gate Open Out 1.65 to 5.5V 32mA Source: Datasheet <https://componentsearchengine.com/Datasheets/2/74LVC1G07SE-7.pdf>; DESCRIPTION: Buffers & Line Drivers Single Gate Open Out 1.65 to 5.5V 32mA; HEIGHT: 1.1mm; MANUFACTURER_NAME: Diodes Inc.; MANUFACTURER_PART_NUMBER: 74LVC1G07SE-7; MOUSER_PART_NUMBER: 621-74LVC1G07SE-7; MOUSER_PRICE-STOCK: https://www.mouser.co.uk/ProductDetail/Diodes-Incorporated/74LVC1G07SE-7?qs=abZ1nkZpTuNoZmx9wrxFdA%3D%3D
U$1 = CM4:RASPBERRYPI-CM4
U$2 U$3 = SamacSys_Parts:SATA-D-PL-RT
X1 = raspberrypi_cm:HDMI
Y1 = SparkFun-Clocks:CRYSTAL-25MHZ: 25MHz Crystal; PROD_ID: XTAL-16235
Y2 = SparkFun-Clocks:CRYSTAL-32.768KHZ: 32.768kHz Crystal Frequency: 32.768kHz Frequency Stability: ±20ppm Load Capacitance: 12.5pF (PTH-2X6 & SMD-3.2X1.5), 6pF (SMD-2X6) SparkFun Products: SparkFun BigTime Watch Kit <https://www.sparkfun.com/products/11734> SparkFun nRF52832 Breakout <https://www.sparkfun.com/products/13990> SparkFun Real Time Clock Module <https://www.sparkfun.com/products/12708>; PROD_ID: XTAL-13062